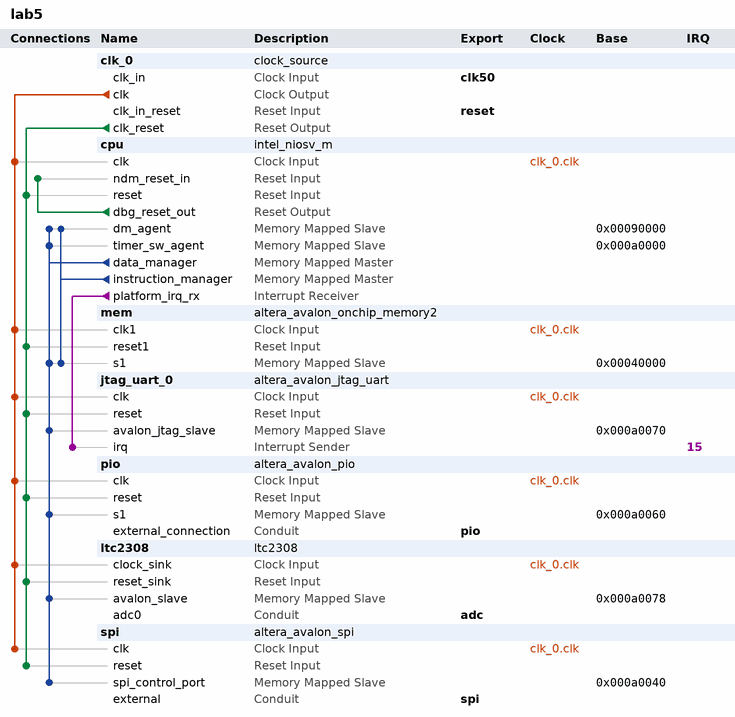
[diagram p0: system contents]
# Platform Designer (Qsys) system lab5, Cyclone V 5CSEMA4U23C6
# Parameters at their usual value, and those the tool derives, are not listed.
package require -exact qsys 24.1
create_system lab5
set_project_property DEVICE_FAMILY {Cyclone V}
set_project_property DEVICE 5CSEMA4U23C6

add_instance clk_0 clock_source 24.1
set_instance_parameter_value clk_0 clockFrequency 50000000

add_instance cpu intel_niosv_m 26.0.0
set_instance_parameter_value cpu enableAvalonInterface true
set_instance_parameter_value cpu enableDebugReset true
set_instance_parameter_value cpu enableECCLite false
set_instance_parameter_value cpu hartId 0
set_instance_parameter_value cpu interruptMode 0
set_instance_parameter_value cpu pipelineArch true
set_instance_parameter_value cpu resetSlave mem.s1

add_instance mem altera_avalon_onchip_memory2 24.1
set_instance_parameter_value mem dataWidth 32
set_instance_parameter_value mem dualPort false
set_instance_parameter_value mem initMemContent true
set_instance_parameter_value mem initializationFileName hello.hex
set_instance_parameter_value mem memorySize 262144
set_instance_parameter_value mem useNonDefaultInitFile true

add_instance jtag_uart_0 altera_avalon_jtag_uart 24.1
set_instance_parameter_value jtag_uart_0 simInteractiveOptions NO_INTERACTIVE_WINDOWS

add_instance pio altera_avalon_pio 24.1
set_instance_parameter_value pio direction Output
set_instance_parameter_value pio width 8

add_instance ltc2308 ltc2308 1.0

add_instance spi altera_avalon_spi 24.1
set_instance_parameter_value spi clockPolarity 0
set_instance_parameter_value spi dataWidth 8
set_instance_parameter_value spi masterSPI true
set_instance_parameter_value spi numberOfSlaves 1
set_instance_parameter_value spi targetClockRate 6000000

# connections
add_connection clk_0.clk cpu.clk clock
add_connection clk_0.clk jtag_uart_0.clk clock
add_connection clk_0.clk ltc2308.clock_sink clock
add_connection clk_0.clk mem.clk1 clock
add_connection clk_0.clk pio.clk clock
add_connection clk_0.clk spi.clk clock
add_connection clk_0.clk_reset cpu.reset reset
add_connection clk_0.clk_reset jtag_uart_0.reset reset
add_connection clk_0.clk_reset ltc2308.reset_sink reset
add_connection clk_0.clk_reset mem.reset1 reset
add_connection clk_0.clk_reset pio.reset reset
add_connection clk_0.clk_reset spi.reset reset
add_connection cpu.dbg_reset_out cpu.ndm_reset_in reset
add_connection cpu.data_manager cpu.dm_agent avalon
set_connection_parameter_value cpu.data_manager/cpu.dm_agent baseAddress 0x00090000
add_connection cpu.data_manager cpu.timer_sw_agent avalon
set_connection_parameter_value cpu.data_manager/cpu.timer_sw_agent baseAddress 0x000a0000
add_connection cpu.data_manager jtag_uart_0.avalon_jtag_slave avalon
set_connection_parameter_value cpu.data_manager/jtag_uart_0.avalon_jtag_slave baseAddress 0x000a0070
add_connection cpu.data_manager ltc2308.avalon_slave avalon
set_connection_parameter_value cpu.data_manager/ltc2308.avalon_slave baseAddress 0x000a0078
add_connection cpu.data_manager mem.s1 avalon
set_connection_parameter_value cpu.data_manager/mem.s1 baseAddress 0x00040000
add_connection cpu.data_manager pio.s1 avalon
set_connection_parameter_value cpu.data_manager/pio.s1 baseAddress 0x000a0060
add_connection cpu.data_manager spi.spi_control_port avalon
set_connection_parameter_value cpu.data_manager/spi.spi_control_port baseAddress 0x000a0040
add_connection cpu.instruction_manager cpu.dm_agent avalon
set_connection_parameter_value cpu.instruction_manager/cpu.dm_agent baseAddress 0x00090000
add_connection cpu.instruction_manager mem.s1 avalon
set_connection_parameter_value cpu.instruction_manager/mem.s1 baseAddress 0x00040000
add_connection cpu.platform_irq_rx jtag_uart_0.irq interrupt
set_connection_parameter_value cpu.platform_irq_rx/jtag_uart_0.irq irqNumber 15

# exported interfaces
add_interface adc conduit end
set_interface_property adc EXPORT_OF ltc2308.adc0
add_interface clk50 clock sink
set_interface_property clk50 EXPORT_OF clk_0.clk_in
add_interface pio conduit end
set_interface_property pio EXPORT_OF pio.external_connection
add_interface reset reset sink
set_interface_property reset EXPORT_OF clk_0.clk_in_reset
add_interface spi conduit end
set_interface_property spi EXPORT_OF spi.external

set_interconnect_requirement {$system} qsys_mm.clockCrossingAdapter HANDSHAKE
set_interconnect_requirement {$system} qsys_mm.enableEccProtection FALSE
set_interconnect_requirement {$system} qsys_mm.insertDefaultSlave FALSE
set_interconnect_requirement {$system} qsys_mm.maxAdditionalLatency 1

save_system lab5.qsys
